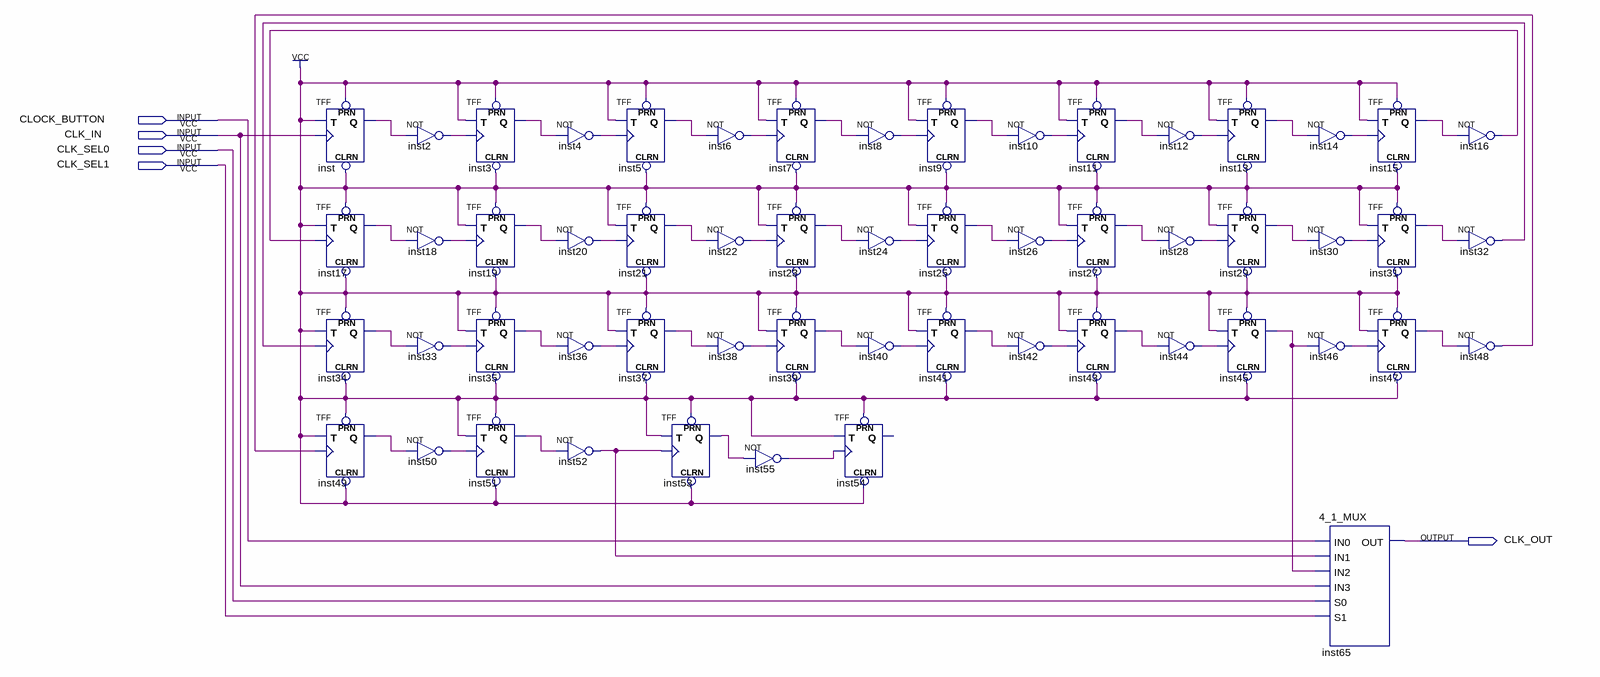
[diagram p0: schematic sheet]
// Quartus schematic SLOW_CLOCK.bdf as structural Verilog: 56 symbols, 5 pins
module SLOW_CLOCK (
  input  CLOCK_BUTTON,
  input  CLK_IN,
  input  CLK_SEL0,
  input  CLK_SEL1,
  output CLK_OUT
);

  wire inst2_out, inst3_q, inst4_out, inst5_q, inst6_out, inst7_q, inst8_out, inst9_q, inst10_out, inst11_q,
       inst12_out, inst13_q, inst14_out, inst15_q, inst16_out, inst17_q, inst18_out, inst19_q, inst20_out,
       inst21_q, inst22_out, inst23_q, inst24_out, inst25_q, inst26_out, inst27_q, inst28_out, inst29_q,
       inst30_out, inst31_q, inst32_out, inst33_out, inst34_q, inst35_q, inst36_out, inst37_q, inst38_out,
       inst39_q, inst40_out, inst41_q, inst42_out, inst43_q, inst44_out, inst45_q, inst46_out, inst47_q,
       inst48_out, inst49_q, inst50_out, inst51_q, inst52_out, inst53_q, inst55_out, inst_q;

  TFF inst (.PRN(1'b1), .CLRN(1'b1), .T(1'b1), .CLK(CLK_IN), .Q(inst_q));
  TFF inst17 (.PRN(1'b1), .CLRN(1'b1), .T(1'b1), .CLK(inst16_out), .Q(inst17_q));
  TFF inst34 (.PRN(1'b1), .CLRN(1'b1), .T(1'b1), .CLK(inst32_out), .Q(inst34_q));
  TFF inst49 (.PRN(1'b1), .CLRN(1'b1), .T(1'b1), .CLK(inst48_out), .Q(inst49_q));
  not inst2 (inst2_out, inst_q);
  not inst18 (inst18_out, inst17_q);
  not inst33 (inst33_out, inst34_q);
  not inst50 (inst50_out, inst49_q);
  TFF inst3 (.PRN(1'b1), .CLRN(1'b1), .T(1'b1), .CLK(inst2_out), .Q(inst3_q));
  TFF inst19 (.PRN(1'b1), .CLRN(1'b1), .T(1'b1), .CLK(inst18_out), .Q(inst19_q));
  TFF inst35 (.PRN(1'b1), .CLRN(1'b1), .T(1'b1), .CLK(inst33_out), .Q(inst35_q));
  TFF inst51 (.PRN(1'b1), .CLRN(1'b1), .T(1'b1), .CLK(inst50_out), .Q(inst51_q));
  not inst4 (inst4_out, inst3_q);
  not inst20 (inst20_out, inst19_q);
  not inst36 (inst36_out, inst35_q);
  not inst52 (inst52_out, inst51_q);
  TFF inst5 (.PRN(1'b1), .CLRN(1'b1), .T(1'b1), .CLK(inst4_out), .Q(inst5_q));
  TFF inst21 (.PRN(1'b1), .CLRN(1'b1), .T(1'b1), .CLK(inst20_out), .Q(inst21_q));
  TFF inst37 (.PRN(1'b1), .CLRN(1'b1), .T(1'b1), .CLK(inst36_out), .Q(inst37_q));
  not inst6 (inst6_out, inst5_q);
  not inst22 (inst22_out, inst21_q);
  not inst38 (inst38_out, inst37_q);
  TFF inst53 (.PRN(1'b1), .CLRN(1'b1), .T(1'b1), .CLK(inst52_out), .Q(inst53_q));
  TFF inst7 (.PRN(1'b1), .CLRN(1'b1), .T(1'b1), .CLK(inst6_out), .Q(inst7_q));
  TFF inst23 (.PRN(1'b1), .CLRN(1'b1), .T(1'b1), .CLK(inst22_out), .Q(inst23_q));
  TFF inst39 (.PRN(1'b1), .CLRN(1'b1), .T(1'b1), .CLK(inst38_out), .Q(inst39_q));
  not inst55 (inst55_out, inst53_q);
  TFF inst54 (.PRN(1'b1), .CLRN(1'b1), .T(1'b1), .CLK(inst55_out));  // open: Q
  not inst8 (inst8_out, inst7_q);
  not inst24 (inst24_out, inst23_q);
  not inst40 (inst40_out, inst39_q);
  TFF inst9 (.PRN(1'b1), .CLRN(1'b1), .T(1'b1), .CLK(inst8_out), .Q(inst9_q));
  TFF inst25 (.PRN(1'b1), .CLRN(1'b1), .T(1'b1), .CLK(inst24_out), .Q(inst25_q));
  TFF inst41 (.PRN(1'b1), .CLRN(1'b1), .T(1'b1), .CLK(inst40_out), .Q(inst41_q));
  not inst10 (inst10_out, inst9_q);
  not inst26 (inst26_out, inst25_q);
  not inst42 (inst42_out, inst41_q);
  TFF inst11 (.PRN(1'b1), .CLRN(1'b1), .T(1'b1), .CLK(inst10_out), .Q(inst11_q));
  TFF inst27 (.PRN(1'b1), .CLRN(1'b1), .T(1'b1), .CLK(inst26_out), .Q(inst27_q));
  TFF inst43 (.PRN(1'b1), .CLRN(1'b1), .T(1'b1), .CLK(inst42_out), .Q(inst43_q));
  not inst12 (inst12_out, inst11_q);
  not inst28 (inst28_out, inst27_q);
  not inst44 (inst44_out, inst43_q);
  TFF inst13 (.PRN(1'b1), .CLRN(1'b1), .T(1'b1), .CLK(inst12_out), .Q(inst13_q));
  TFF inst29 (.PRN(1'b1), .CLRN(1'b1), .T(1'b1), .CLK(inst28_out), .Q(inst29_q));
  TFF inst45 (.PRN(1'b1), .CLRN(1'b1), .T(1'b1), .CLK(inst44_out), .Q(inst45_q));
  not inst14 (inst14_out, inst13_q);
  not inst30 (inst30_out, inst29_q);
  not inst46 (inst46_out, inst45_q);
  \4_1_MUX  inst65 (
    .IN0(CLOCK_BUTTON), .IN1(inst52_out), .IN2(inst45_q), .IN3(CLK_IN), .S0(CLK_SEL0), .S1(CLK_SEL1),
    .OUT(CLK_OUT));
  TFF inst15 (.PRN(1'b1), .CLRN(1'b1), .T(1'b1), .CLK(inst14_out), .Q(inst15_q));
  TFF inst31 (.PRN(1'b1), .CLRN(1'b1), .T(1'b1), .CLK(inst30_out), .Q(inst31_q));
  TFF inst47 (.PRN(1'b1), .CLRN(1'b1), .T(1'b1), .CLK(inst46_out), .Q(inst47_q));
  not inst16 (inst16_out, inst15_q);
  not inst32 (inst32_out, inst31_q);
  not inst48 (inst48_out, inst47_q);
endmodule
